# Altium schematic sheet Interfaces.SchDoc
size B; CompanyName: Rigado, LLC; Organization: Rigado, LLC; SheetNumber: 2; SheetSize: B; SheetTitle: LED Driver
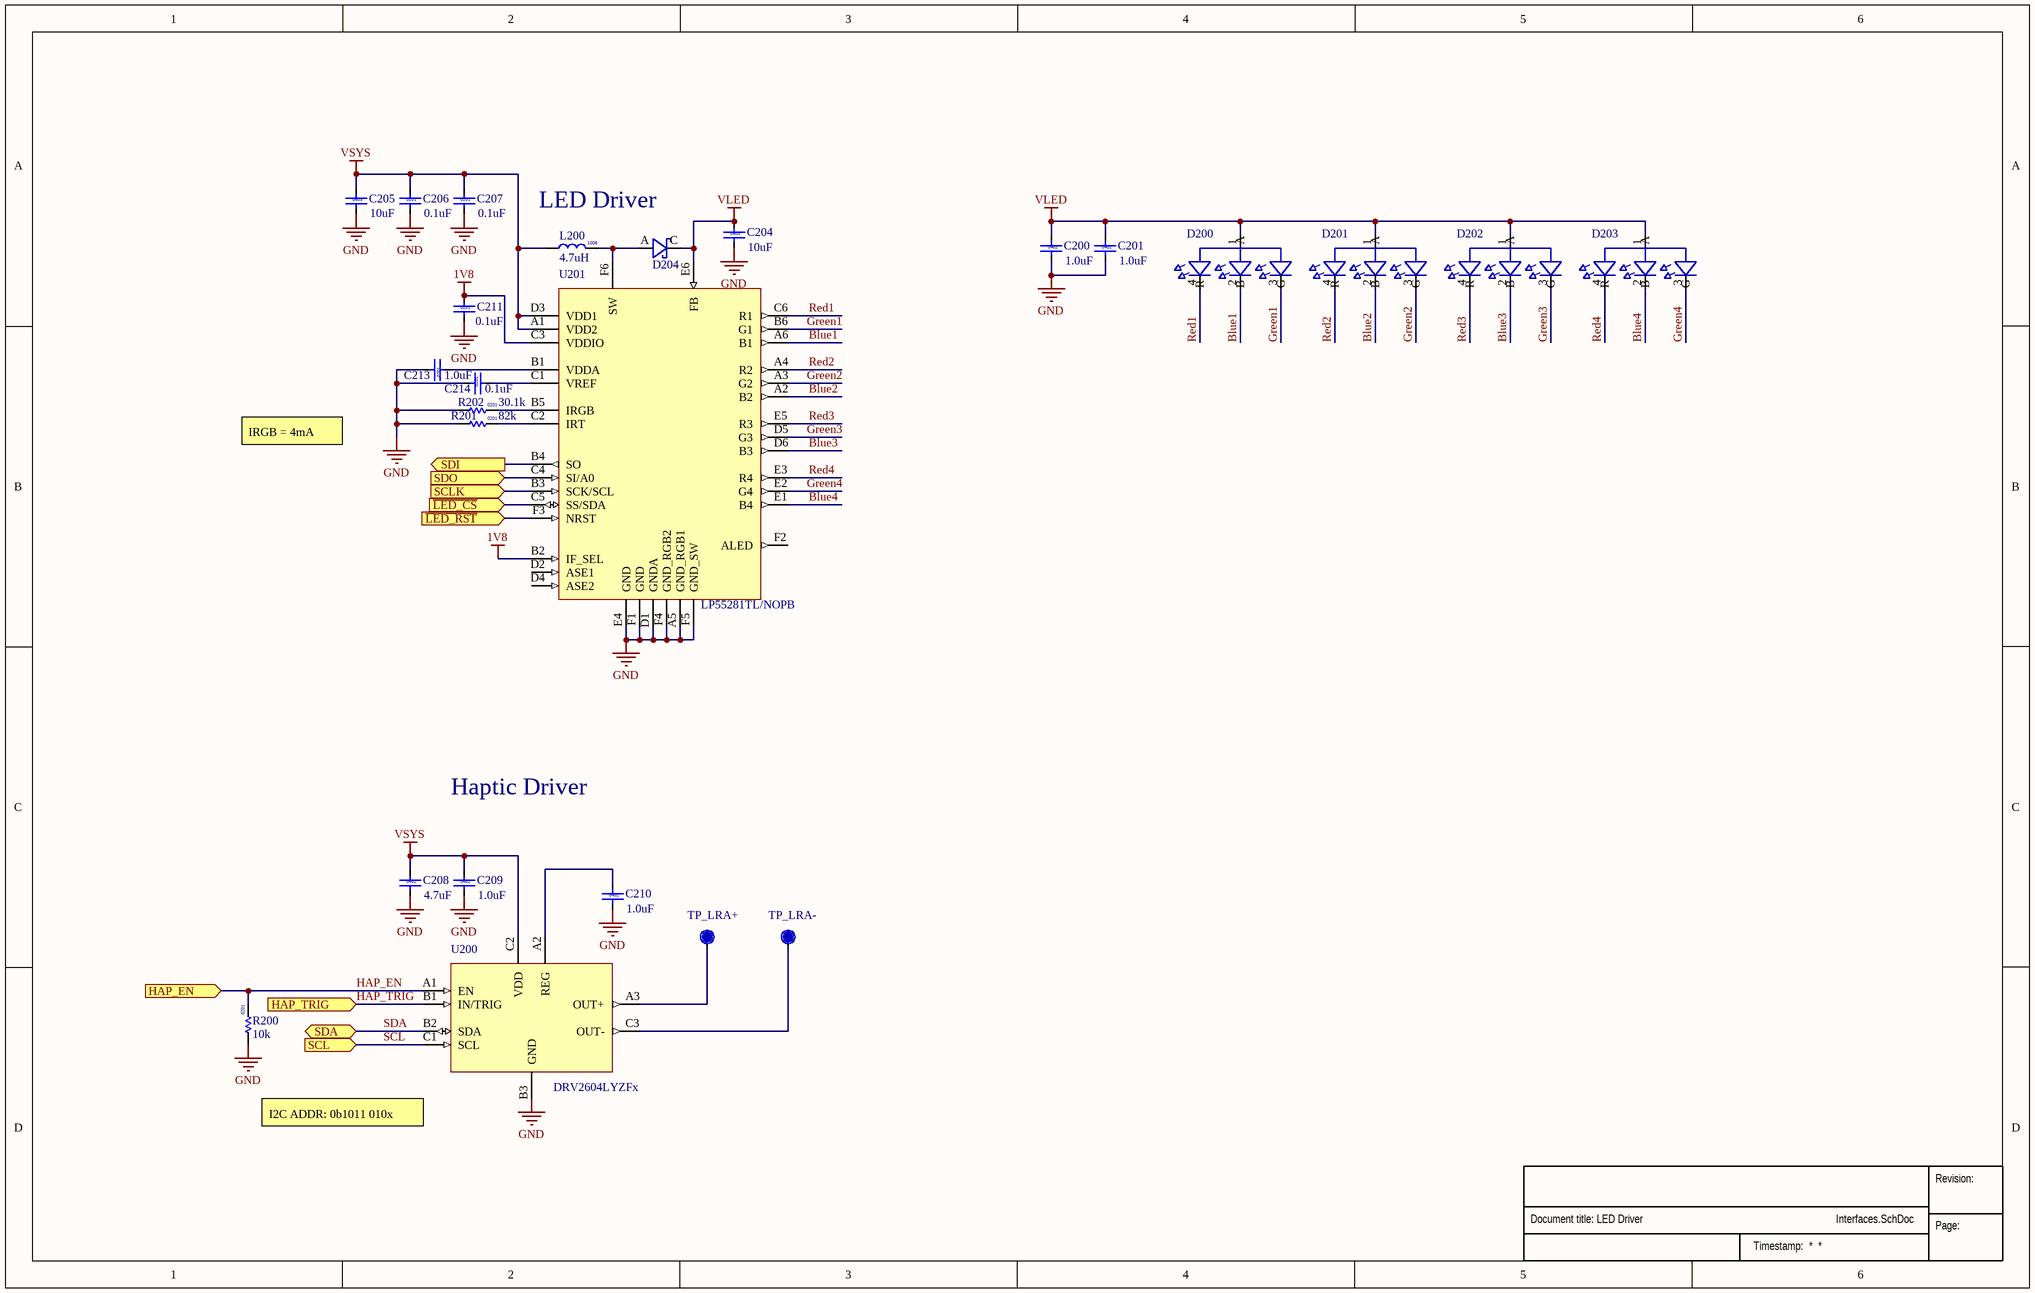
[diagram p0: Interfaces.SchDoc]

## Parts
?  (no value)  (graphical)
C200  value 1.0uF  Size: 0402  [Cap 0402 HD]  (hidden comment: Cap 0402 1.0uF 10V1.0uF)
C201  value 1.0uF  Size: 0402  [Cap 0402 HD]  (hidden comment: Cap 0402 1.0uF 10V1.0uF)
C204  value 10uF  Size: 0603  [Cap 0603]  (hidden comment: Cap 0603 10uF 10V10uF)
C205  value 10uF  Size: 0603  [Cap 0603]  (hidden comment: Cap 0603 10uF 10V10uF)
C206  value 0.1uF  Size: 0201  [Cap 0201 HD]  (hidden comment: Cap 0201 0.1uF 6.3V0.1uF)
C207  value 0.1uF  Size: 0201  [Cap 0201 HD]  (hidden comment: Cap 0201 0.1uF 6.3V0.1uF)
C208  value 4.7uF  Size: 0402  [Cap 0402 HD]  (hidden comment: Cap 0402 4.7uF 10V4.7uF)
C209  value 1.0uF  Size: 0402  [Cap 0402 HD]  (hidden comment: Cap 0402 1.0uF 10V1.0uF)
C210  value 1.0uF  Size: 0402  [Cap 0402 HD]  (hidden comment: Cap 0402 1.0uF 10V1.0uF)
C211  value 0.1uF  Size: 0201  [Cap 0201 HD]  (hidden comment: Cap 0201 0.1uF 6.3V0.1uF)
C213  value 1.0uF  Size: 0201  [Cap 0201 HD]  (hidden comment: Cap 0201 1.0uF 6.3V1.0uF)
C214  value 0.1uF  Size: 0201  [Cap 0201 HD]  (hidden comment: Cap 0201 0.1uF 6.3V0.1uF)
D200  CLMVB-FKA-CFHEHLCBB7A363  [4-PLCC]  (value not drawn)
D201  CLMVB-FKA-CFHEHLCBB7A363  [4-PLCC]  (value not drawn)
D202  CLMVB-FKA-CFHEHLCBB7A363  [4-PLCC]  (value not drawn)
D203  CLMVB-FKA-CFHEHLCBB7A363  [4-PLCC]  (value not drawn)
D204  MBR120VLSFT3G20V  [SOD-123F_U]  (value not drawn)
L200  value 4.7uH  Size: 1008  [IND 1008]  (hidden comment: Ind 1008 4.7uH 650mA4.7uH)
R200  value 10k  Size: 0201  [RES 0201 HD]  (hidden comment: Res 0201 10k 5%10k)
R201  value 82k  Size: 0201  [RES 0201 HD]  (hidden comment: Res 0201 Generic82k)
R202  value 30.1k  Size: 0201  [RES 0201 HD]  (hidden comment: Res 0201 Generic30.1k)
TP_LRA+  TP  [TP17R]  (value not drawn)
TP_LRA-  TP  [TP17R]  (value not drawn)
U200  Manufacturer P/N: DRV2604LYZFx  [BGA0.5P3x3-9Pin]  (hidden comment: DRV2604L)
U201  Manufacturer P/N: LP55281TL/NOPB  [BGA0.5P6x6-36Pin]  (hidden comment: LP55281TL)

## Ports
HAP_EN (in), HAP_TRIG (in), SCL (in), SCLK (in), SDA (bidir), SDI (out), SDO (in), ~{LED_CS} (in), ~{LED_RST} (in)

## Nets
1V8: C211.1 U201.B2(IF_SEL) U201.C3(VDDIO)
GND: C200.2 C201.2 C204.2 C205.2 C206.2 C207.2 C208.2 C209.2 C210.2 C211.2 C213.2 C214.1 R200.1 R201.1 R202.1 U200.B3(GND) U201.A5(GND_RGB1) U201.D1(GNDA) U201.E4(GND) U201.F1(GND) U201.F4(GND_RGB2) U201.F5(GND_SW)
VLED: C200.1 C201.1 C204.1 D200.1(A) D201.1(A) D202.1(A) D203.1(A) D204.C U201.E6(FB)
VSYS: C205.1 C206.1 C207.1 C208.1 C209.1 L200.1 U200.C2(VDD) U201.A1(VDD2) U201.D3(VDD1)
~{LED_CS}: U201.C5(SS/SDA) ; port ~{LED_CS}
~{LED_RST}: U201.F3(NRST) ; port ~{LED_RST}
Blue1: D200.2(B) U201.A6(B1)
Blue2: D201.2(B) U201.A2(B2)
Blue3: D202.2(B) U201.D6(B3)
Blue4: D203.2(B) U201.E1(B4)
Green1: D200.3(G) U201.B6(G1)
Green2: D201.3(G) U201.A3(G2)
Green3: D202.3(G) U201.D5(G3)
Green4: D203.3(G) U201.E2(G4)
HAP_EN: R200.2 U200.A1(EN) ; port HAP_EN
HAP_TRIG: U200.B1(IN/TRIG) ; port HAP_TRIG
Red1: D200.4(R) U201.C6(R1)
Red2: D201.4(R) U201.A4(R2)
Red3: D202.4(R) U201.E5(R3)
Red4: D203.4(R) U201.E3(R4)
SCL: U200.C1(SCL) ; port SCL
SCLK: U201.B3(SCK/SCL) ; port SCLK
SDA: U200.B2(SDA) ; port SDA
SDI: U201.B4(SO) ; port SDI
SDO: U201.C4(SI/A0) ; port SDO
NetC210_1: C210.1 U200.A2(REG)
NetC213_1: C213.1 U201.B1(VDDA)
NetC214_2: C214.2 U201.C1(VREF)
NetD204_A: D204.A L200.2 U201.F6(SW)
NetR201_2: R201.2 U201.C2(IRT)
NetR202_2: R202.2 U201.B5(IRGB)
NetTP_LRA+_1: TP_LRA+.1 U200.A3(OUT+)
NetTP_LRA-_1: TP_LRA-.1 U200.C3(OUT-)

Not connected (* = marked no-connect by the designer): U201 D2(ASE1) D4(ASE2) F2(ALED)

## Notes on the sheet
- LED Driver
- IRGB = 4mA
- Haptic Driver
- (near U200) I2C ADDR: 0b1011 010x
- Revision:
- Page:

## Library data of the parts
? = Sub_Title_Block: Minimized schematic title block for all subset sheets
C200 C201 C209 C210 = Cap 0402 1.0uF 10V: Cap, Ceramic 1.0uF 10V 10% X5R 0402; Manufacturer P/N: GRM155R61A105KE15D; Manufacturer: Murata; Manufacturer 2 P/N: C1005X5R0J105K050BB; Vendor: Digikey; Vendor P/N: 490-3890-1-ND; Added By: Jeremy D; Part Number: Cap 0402 1.0uF 10V; Tolerance: 10%; Voltage: 10V; Manufacturer 2: TDK; Height: 0.55mm; Temp Coefficient: X5R; Added Date: 2/1/2015; Checked By: Paul B; Checked Date: 2/5/2015
C204 C205 = Cap 0603 10uF 10V: Cap, Ceramimic 10uF 10V 20% X5R 0603; Manufacturer P/N: C1608X5R1A106M080AC; Manufacturer: TDK; Manufacturer 2 P/N: LMK107BBJ106MAHT; Vendor: Digikey; Vendor P/N: 445-6853-1-ND; Added By: Jeremy D; Part Number: Cap 0603 10uF 10V; Tolerance: 20%; Voltage: 10V; Manufacturer 2: Taiyo Yuden; Temp Coefficient: X5R; Height: 0.9mm; Added Date: 12/12/2014; Checked By: Cam N; Checked Date: 2/27/2015
C206 C207 C211 C214 = Cap 0201 0.1uF 6.3V: Cap, Ceramic 0.1uF 6.3V 10% X5R  0201; Manufacturer P/N: GRM033R60J104KE19D; Manufacturer: Murata; Manufacturer 2 P/N: C0603X5R0J104K030BC; Vendor: Digikey; Vendor P/N: 490-3167-1-ND; Added By: Jeremy D; Part Number: Cap 0201 0.1uF 6.3V; Tolerance: 10%; Voltage: 6.3V; Manufacturer 2: TDK; Temp Coefficient: X5R; Height: 0.33mm; Added Date: 2/1/2015; Checked By: Cam N; Checked Date: 2/27/2015
C208 = Cap 0402 4.7uF 10V: Cap, Ceramic 4.7uF 10V 20% X5R 0402; Manufacturer P/N: CL05A475MP5NRNC; Manufacturer: Samsung; Manufacturer 2 P/N: C1005X5R1A475M050BC; Vendor: Digikey; Vendor P/N: 1276-1482-1-ND; Added By: Jeremy D; Part Number: Cap 0402 4.7uF 10V; Tolerance: 20%; Voltage: 10V; Manufacturer 2: TDK; Height: 0.55m; Temp Coefficient: X5R; Added Date: 2/1/2015; Checked By: Paul B; Checked Date: 2/5/2015
C213 = Cap 0201 1.0uF 6.3V: Cap, Ceramic 1.0uF 6.3V 20% X5R  0201; Manufacturer P/N: CL03A105MQ3CSNC; Manufacturer: Samsung; Manufacturer 2 P/N: C0603X5R0J105M030BC; Vendor: Digi-key; Vendor P/N: 1276-1325-1-ND; Added By: Jeremy D; Part Number: Cap 0201 1.0uF 6.3V; Tolerance: 20%; Voltage: 6.3V; Manufacturer 2: TDK; Temp Coefficient: X5R; Height: 0.33mm; Added Date: 2/24/2015; Checked By: Cam N; Checked Date: 2/27/2015
D200-D203 = CLMVB-FKA-CFHEHLCBB7A363: RGB LED SMD, Diffused; Manufacturer: Cree; Voltage Rated: 2.6V, 3.8V, 3.8V; Idc: 20mA, 10mA, 10mA; Added By: Jeremy D; Part Number: CLMVB-FKA-CFHEHLCBB7A363; Manufacturer P/N: CLMVB-FKA-CFHEHLCBB7A363; Size: 2.1mm x 2.1mm; Package: 4-PLCC; Height: 1mm; Type: LED; Color: RGB; Supplier 1: Mouser; Supplier Part Number 1: 941-CLMVBFKACFHEHLCB; Added Date: 2/20/2015; Checked By: Cam N; Checked Date: 2/27/2015
D204 = MBR120VLSFT3G: Diode, Schottky, 20V 1A SOD-123F, 340mV Vf @ 1A; Manufacturer: ON Semi; Manufacturer 2 P/N: PMEG2010ER,115; Added By: Jeremy D; Part Number: MBR120VLSFT3G; Manufacturer P/N: MBR120VLSFT3G; Manufacturer 2: NXP; Size: 3.8mm x 1.8mm; Package: SOD-123F; Height: 1.1mm; Voltage Rated: 20V; Idc: 1A; Type: Schottky; Color: N/A; Supplier 1: Digi-key; Supplier Part Number 1: MBR120VLSFT3GOSCT-ND; Added Date: 3/24/2015
L200 = Ind 1008 4.7uH 650mA: Inductor, 4.7uH, 1008; Manufacturer P/N: CIG22B4R7MNE; Manufacturer: Samsung; Manufacturer 2 P/N: CIG22H4R7MNE; Tolerance: 20%; Vendor: Digikey; Vendor P/N: 1276-6218-1-ND; Isat: 650mA; Added By: Jeremy D; Part Number: Ind 1008 4.7uH 650mA; Manufacturer 2: Samsung; Height: 1mm; Added Date: 2/20/2015; Checked By: Cam N; Checked Date: 2/27/2015
R200 = Res 0201 10k 5%: Resistor 10k ohm 5% 1/20W 0201; Manufacturer: Rohm; Manufacturer P/N: MCR006YRTJ103; Manufacturer 2 P/N: ERJ-1GEJ103C; Vendor: Digikey; Vendor P/N: RHM10KCCCT-ND; Added By: Jeremy D; Part Number: Res 0201 10k 5%; Manufacturer 2: Panasonic; Tolerance: 5%; Height: 0.26mm; Power: 1/20W; Added Date: 2/1/2015; Checked By: Paul B; Checked Date: 2/5/2015
R201 R202 = Res 0201 Generic: Resistor, 0201; Added By: Jeremy D; Part Number: Res 0201 Generic; Height: 0.26mm; Added Date: 12/12/2014; Checked By: Paul B; Checked Date: 2/5/2015
TP_LRA+ TP_LRA- = TP17R: Testpoint, Round 1.7mm Dia; Added By: Jeremy D; Part Number: TP17R; Size: 1.7mm; Height: 0; DNP: DNP; Added Date: 2/1/2015; Checked By: Paul B; Checked Date: 2/5/2015
U200 = DRV2604L: Haptic Driver w/Internal Memory, I2C, DSBGA 9; Manufacturer: Texas Instruments; MFG Footprint: DSBGA 9 (YZF); Voltage-Rated: 5.2V; Vendor: Arrow; Added By: Jeremy D; Part Number: DRV2604L; Height: .625mm; Size: 1.47mm x 1.47mm; Packaging: Tape & Reel; Features: LRA and ERM Haptic Driver w/Memory and Trigger input; Controller Interface: I2C; Added Date: 1/30/2015; Checked By: Paul B; Checked Date: 2/5/2015
U201 = LP55281TL: Quad RGB LED driver w/integrated boost supply and audio sync; Manufacturer: Texas Instruments; MFG Footprint: YZR0036; Voltage-Rated: 5.5V; Controller Interface: SPI/I2C; Added By: Jeremy D; Part Number: LP55281TL; Height: 0.68mm; Size: 3.013mm x 3.013mm; Features: Integrated LED boost, Audio sync; Supplier 1: Digi-key; Supplier Part Number 1: LP55281TL/NOPBCT-ND; Added Date: 3/24/2015; Checked By: Paul B; Checked Date: 5/12/2015